# EasyEDA Pro project ProPrj_KernRePeter_2025-12-13.epro

# Schematic KernRePeter
Board Name: RePeter; Create Date: 2025-11-22; Page Name: P1; Project Name: KernRePeter; Schematic Name: KernRePeter; Update Date: 2025-12-12; Company: BreMesh; Page Size: A4; Version: V1.0
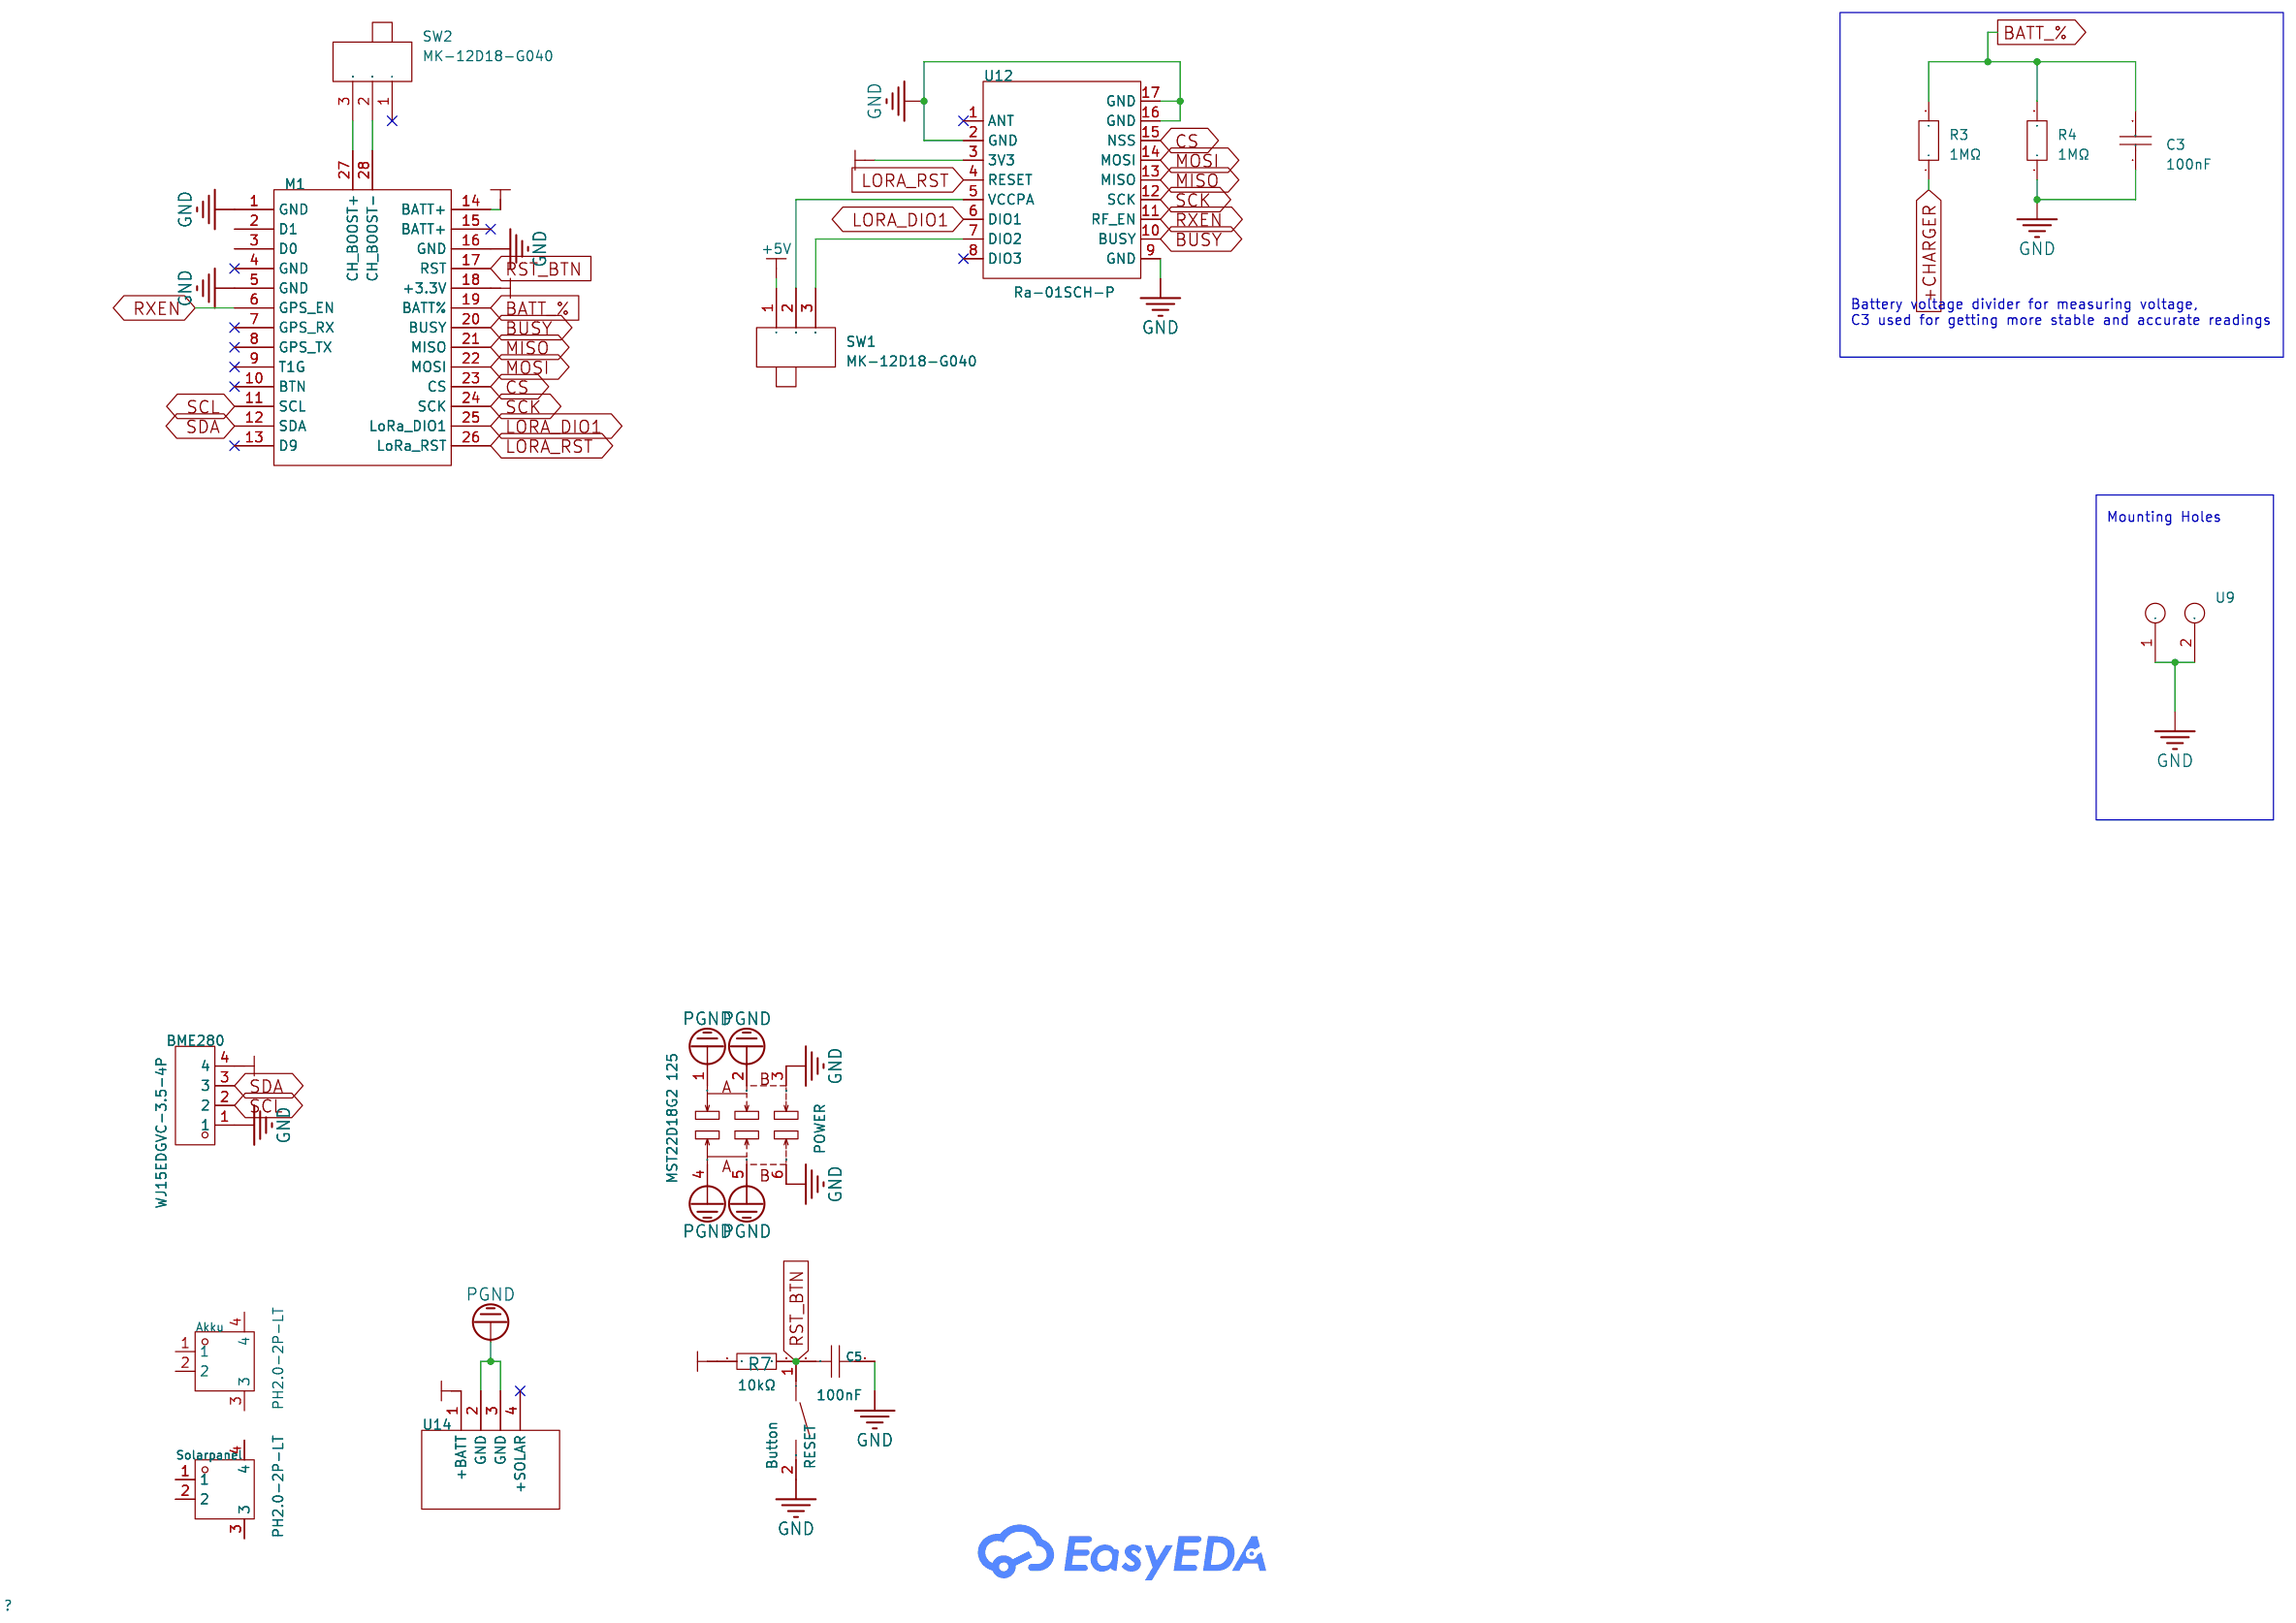
[diagram p0: schematic sheet]

## Parts
Akku  PH2.0-2P-LT  [CONN-SMD_PH2.0-1X2PW]
BME280  WJ15EDGVC-3.5-4P  [CONN-TH_WJ15EDGVC-3.5-4P]
C3  100nF  [C0805]
C5  100nF  [C0603]
M1  ProMicro_NRF52840  [ProMicro_NRF52840]
POWER  MST22D18G2 125  [SW-SMD_MST22D18G2]
R3  1MΩ  [R0805]
R4  1MΩ  [R0805]
R7  10kΩ  [R0603]
RESET  Button  [SW-SMD_L3.9-W3.0-P4.45]
Solarpanel  PH2.0-2P-LT  [CONN-SMD_PH2.0-1X2PW]
SW1  MK-12D18-G040  [SW-TH_MK-12D18-G040]
SW2  MK-12D18-G040  [SW-TH_MK-12D18-G040]
U9  -  [MountingHole_ES101590]
U12  Ra-01SCH-P  [WIRELM-SMD_RA-01SCH-P]
U14  -  [MPPT_Charging_Board]

## Library data of the parts
Akku Solarpanel = PH2.0-2P-LT: Pins Structure:1x2P Pitch:2mm Mounting Type:Surface Mount,Vertical Reference Series:- Number of Pins:2P Number of Rows:1 Number of PINs Per Row:2 Row Spacing:- Current Rating:- Contact Material:Brass Contact Plating:Tin Operating Temperature:- Operating T; LCSC Part Name: 1x2P 间距:2mm 立贴; Supplier Part: C722761; Manufacturer: CAX(创都); Supplier Footprint: SMD,P=2mm; JLCPCB Part Class: Extended Part; Datasheet: https://item.szlcsc.com/datasheet/PH2.0-2P-LT/766968.html; Supplier: LCSC; Pins Structure: 1x2P; Pitch: 2mm; Mounting Type: Surface Mount,Vertical; Number of Pins: 2P; Number of Rows: 1; Number of PINs Per Row: 2; Contact Material: Brass; Contact Plating: Tin; Plastic Material: LCP; Flame Retardant Rating: UL94V-0; Color: Beige; Z-Height of the Board: 6.5mm; X-Length of Bottom Edge on Board (Spacing Line): 8mm; Y-Width of Bottom Edge on Board: 5.4mm
BME280 = WJ15EDGVC-3.5-4P_C5241856: Connector Type:Board Side/Socket - Closed Termination Style:- Number of Positions or Pins:1x4P Pitch:3.5mm Color:- Mounting Type:Straight Pin Number of Pins:4P Number of Rows:1 Number of PINs Per Row:4 Current Rating:- Voltage Rating (Max):- Wire Gauge -; LCSC Part Name: 1x4P 3.5mm 排数:1 每排P数:4; Supplier Part: C5241856; Manufacturer: KANGNEX(康奈克斯电气); Supplier Footprint: 插件,P=3.5mm; JLCPCB Part Class: Extended Part; Datasheet: https://item.szlcsc.com/datasheet/WJ15EDGVC-3.5-4P/5949260.html; Supplier: LCSC; Connector Type: Board Side/Socket - Closed; Number of Positions or Pins: 1x4P; Pitch: 3.5mm; Mounting Type: Straight Pin; Number of Pins: 4P; Number of Rows: 1; Number of PINs Per Row: 4; Operating Temperature: -40℃~+105℃
C3 = 0805B104J500NT: Capacitance:100nF Tolerance:±5% Tolerance:±5% Voltage Rating:50V Temperature Coefficient:X7R; LCSC Part Name: 100nF ±5% 50V; Supplier Part: C29926; Manufacturer: FH(风华); Supplier Footprint: 0805; JLCPCB Part Class: Extended Part; Datasheet: https://item.szlcsc.com/datasheet/0805B104J500NT/30680.html; Supplier: LCSC; Tolerance: ±5%; Voltage Rating: 50V; Temperature Coefficient: X7R
C5 = CL10B104KB8NNNC: Capacitance:100nF Tolerance:±10% Tolerance:±10% Voltage Rating:50V Temperature Coefficient:X7R; LCSC Part Name: 100nF ±10% 50V; Supplier Part: C1591; Manufacturer: SAMSUNG(三星); Supplier Footprint: 0603; JLCPCB Part Class: Extended Part; Datasheet: https://item.szlcsc.com/datasheet/CL10B104KB8NNNC/1943.html; Supplier: LCSC; Tolerance: ±10%; Voltage Rating: 50V; Temperature Coefficient: X7R
M1 = ProMicro_NRF52840
POWER = MST22D18G2 125: Circuit:DPDT Termination Style:Gull Wing Mounting Type:Surface Mount,Vertical Actuator Color:Black Current Rating:100mA Voltage Rating:12V Life:10,000 Cycles Operating Temperature:-25℃~+70℃ Operating Temperature:-25℃~+70℃; LCSC Part Name: 拨动开关/两档立式 6脚贴片 柄长2.0mm 大六立贴 9.1*3.5mm; Supplier Part: C2906280; Manufacturer: SHOU HAN(首韩); Supplier Footprint: SMD; JLCPCB Part Class: Extended Part; Datasheet: https://item.szlcsc.com/datasheet/MST22D18G2%2520125/3178990.html; Supplier: LCSC; Circuit: DPDT; Termination Style: Gull Wing; Mounting Type: Surface Mount,Vertical; Actuator Color: Black; Current Rating: 100mA; Voltage Rating: 12V; Life: 10,000 Cycles; Operating Temperature: -25℃~+70℃
R3 R4 = RT0805BRD071ML: Type:Thin Film Resistor Resistance: Tolerance:±0.1% Tolerance:±0.1% Power(Watts): Overload Voltage (Max): Temperature Coefficient:±25ppm/℃ Temperature Coefficient:±25ppm/℃ Operating Temperature Range:-55℃~+155℃ Operating Temperature Range:-55℃~+155℃; LCSC Part Name: 薄膜电阻 1MΩ ±0.1% 125mW; Supplier Part: C706228; Manufacturer: YAGEO(国巨); Supplier Footprint: 0805; JLCPCB Part Class: Extended Part; Datasheet: https://atta.szlcsc.com/upload/public/pdf/source/20200720/C706228_E467826006C51DA6221B9BCD121425CF.pdf; Supplier: LCSC; Type: Thin Film Resistor; Tolerance: ±0.1%; Temperature Coefficient: ±25ppm/℃; Operating Temperature Range: -55℃~+155℃
R7 = 0603WAF1002T5E: Type:Thick Film Resistor Resistance:10kΩ Tolerance:±1% Tolerance:±1% Power(Watts):100mW Voltage-Supply(Max):75V Temperature Coefficient:±100ppm/℃ Temperature Coefficient:±100ppm/℃ Operating Temperature:-55℃~+155℃ Operating Temperature:-55℃~+155℃; LCSC Part Name: 厚膜电阻 10kΩ ±1% 100mW; Supplier Part: C25804; Manufacturer: UNI-ROYAL(厚声); Supplier Footprint: 0603; JLCPCB Part Class: Basic Part; Datasheet: https://item.szlcsc.com/datasheet/0603WAF1002T5E/26547.html; Supplier: LCSC; Type: Thick Film Resistor; Tolerance: ±1%; Power(Watts): 100mW; Voltage-Supply(Max): 75V; Temperature Coefficient: ±100ppm/℃; Operating Temperature: -55℃~+155℃
RESET = TS-1088-AR02016: Circuit:SPST Actuator Style:Round Button Operating Force:1.6N Mounting Type:Surface Mount,Vertical Length:4mm Width:3mm Switch Height:2mm with Bracket:Without Bracket Contact Current:50mA Voltage Rating:12V Actuator/Cap Color:Black Termination Style:SMD(S; LCSC Part Name: 4*3*2mm 立贴 轻触开关; Supplier Part: C720477; Manufacturer: XUNPU(讯普); Supplier Footprint: SMD,4x3mm; JLCPCB Part Class: Basic Part; Datasheet: https://item.szlcsc.com/datasheet/TS-1088-AR02016/763484.html; Supplier: LCSC; Circuit: SPST; Actuator Style: Round Button; Operating Force: 1.6N; Mounting Type: Surface Mount,Vertical; Length: 4mm; Width: 3mm; Switch Height: 2mm; with Bracket: Without Bracket; Contact Current: 50mA; Voltage Rating: 12V; Actuator/Cap Color: Black; Termination Style: SMD(SMT) Tab; Life: 100,000 Cycles; Operating Temperature: -30℃~+80℃
SW1 SW2 = MK-12D18-G040: Circuit:SPDT Actuator Style:Rectangular columnar Pin Style:PCPin Switch Length:8.55mm Switch Width:3.8mm Mounting Style:- Actuator Color:Black Current Rating (DC):1A Voltage Rating (DC):6V Mechanical Life:1万次 Operating Temperature:-20℃~+70℃ Operating Temp; LCSC Part Name: 微型拨动开关; Supplier Part: C963202; Manufacturer: G-Switch(品赞); Supplier Footprint: 插件; JLCPCB Part Class: Extended Part; Datasheet: https://atta.szlcsc.com/upload/public/pdf/source/20201201/C963202_825FB742C5BA766BED52E1DDA96DE5A3.pdf; Supplier: LCSC; Circuit: SPDT; Actuator Style: Rectangular columnar; Pin Style: PCPin; Switch Length: 8.55mm; Switch Width: 3.8mm; Actuator Color: Black; Current Rating (DC): 1A; Voltage Rating (DC): 6V; Mechanical Life: 1万次; Operating Temperature: -20℃~+70℃
U9 = MountingHoles_ES101590
U12 = Ra-01SCH-P: Output Power:31dBm Output Power:31dBm Interface Type:SPI Modulation System:LoRa；GFSK；FSK Voltage - Supply:3V~3.6V Voltage - Supply:3V~3.6V Antenna Type:IPEX Connector Receive  Current:16mA Send  Current:1A Sensitivity:-137dBm Sensitivity:-137dBm; Supplier Part: C41368034; Manufacturer: Ai-Thinker(安信可); Supplier Footprint: SMD,17x16mm; JLCPCB Part Class: Extended Part; Datasheet: https://item.szlcsc.com/datasheet/Ra-01SCH-P/43122705.html; Supplier: LCSC; Output Power: 31dBm; Interface Type: SPI; Modulation System: LoRa；GFSK；FSK; Voltage - Supply: 3V~3.6V; Antenna Type: IPEX Connector; Receive  Current: 16mA; Send  Current: 1A; Sensitivity: -137dBm
U14 = CN3791 MPPT Solar Charger v1.0

## Nets
+3.3V: BME280.4 M1.18(+3.3V) R7.1 U12.3(3V3)
+5V: SW1.1
GND: BME280.1 C3.1 C5.2 M1.1(GND) M1.5(GND) M1.16(GND) POWER.3 POWER.6 R4.1 RESET.2 U9.1 U9.2 U12.2(GND) U12.9(GND) U12.16(GND) U12.17(GND)
PGND: POWER.1 POWER.2 POWER.4 POWER.5 U14.2(GND) U14.3(GND)
+CHARGER: M1.14(BATT+) R3.1 U14.1(+BATT)
BATT_%: C3.2 M1.19(BATT%) R3.2 R4.2
BUSY: M1.20(BUSY) U12.10(BUSY)
CS: M1.23(CS) U12.15(NSS)
LORA_DIO1: M1.25(LoRa DIO1) U12.6(DIO1)
LORA_RST: M1.26(LoRa RST) U12.4(RESET)
MISO: M1.21(MISO) U12.13(MISO)
MOSI: M1.22(MOSI) U12.14(MOSI)
RST_BTN: C5.1 M1.17(RST) R7.2 RESET.1
RXEN: M1.6(GPS_EN) U12.11(RF_EN)
SCK: M1.24(SCK) U12.12(SCK)
SCL: BME280.2 M1.11(SCL)
SDA: BME280.3 M1.12(SDA)
$1N567: SW1.2 U12.5(VCCPA)
$1N14763: SW1.3 U12.7(DIO2)
$1N15587: M1.28(CH_BOOST-) SW2.2
$1N15596: M1.27(CH_BOOST+) SW2.3

Not connected (* = marked no-connect by the designer): Akku 1 2 3 4; M1 2(D1) 3(D0) 4(GND)* 7(GPS_RX)* 8(GPS_TX)* 9(T1G)* 10(BTN)* 13(D9)* 15(BATT+)*; Solarpanel 1 2 3 4; SW2 1*; U12 1(ANT)* 8(DIO3)*; U14 4(+SOLAR)*

## Notes on the sheet
- Battery voltage divider for measuring voltage,
  C3 used for getting more stable and accurate readings
- Mounting Holes

# Board RePeter
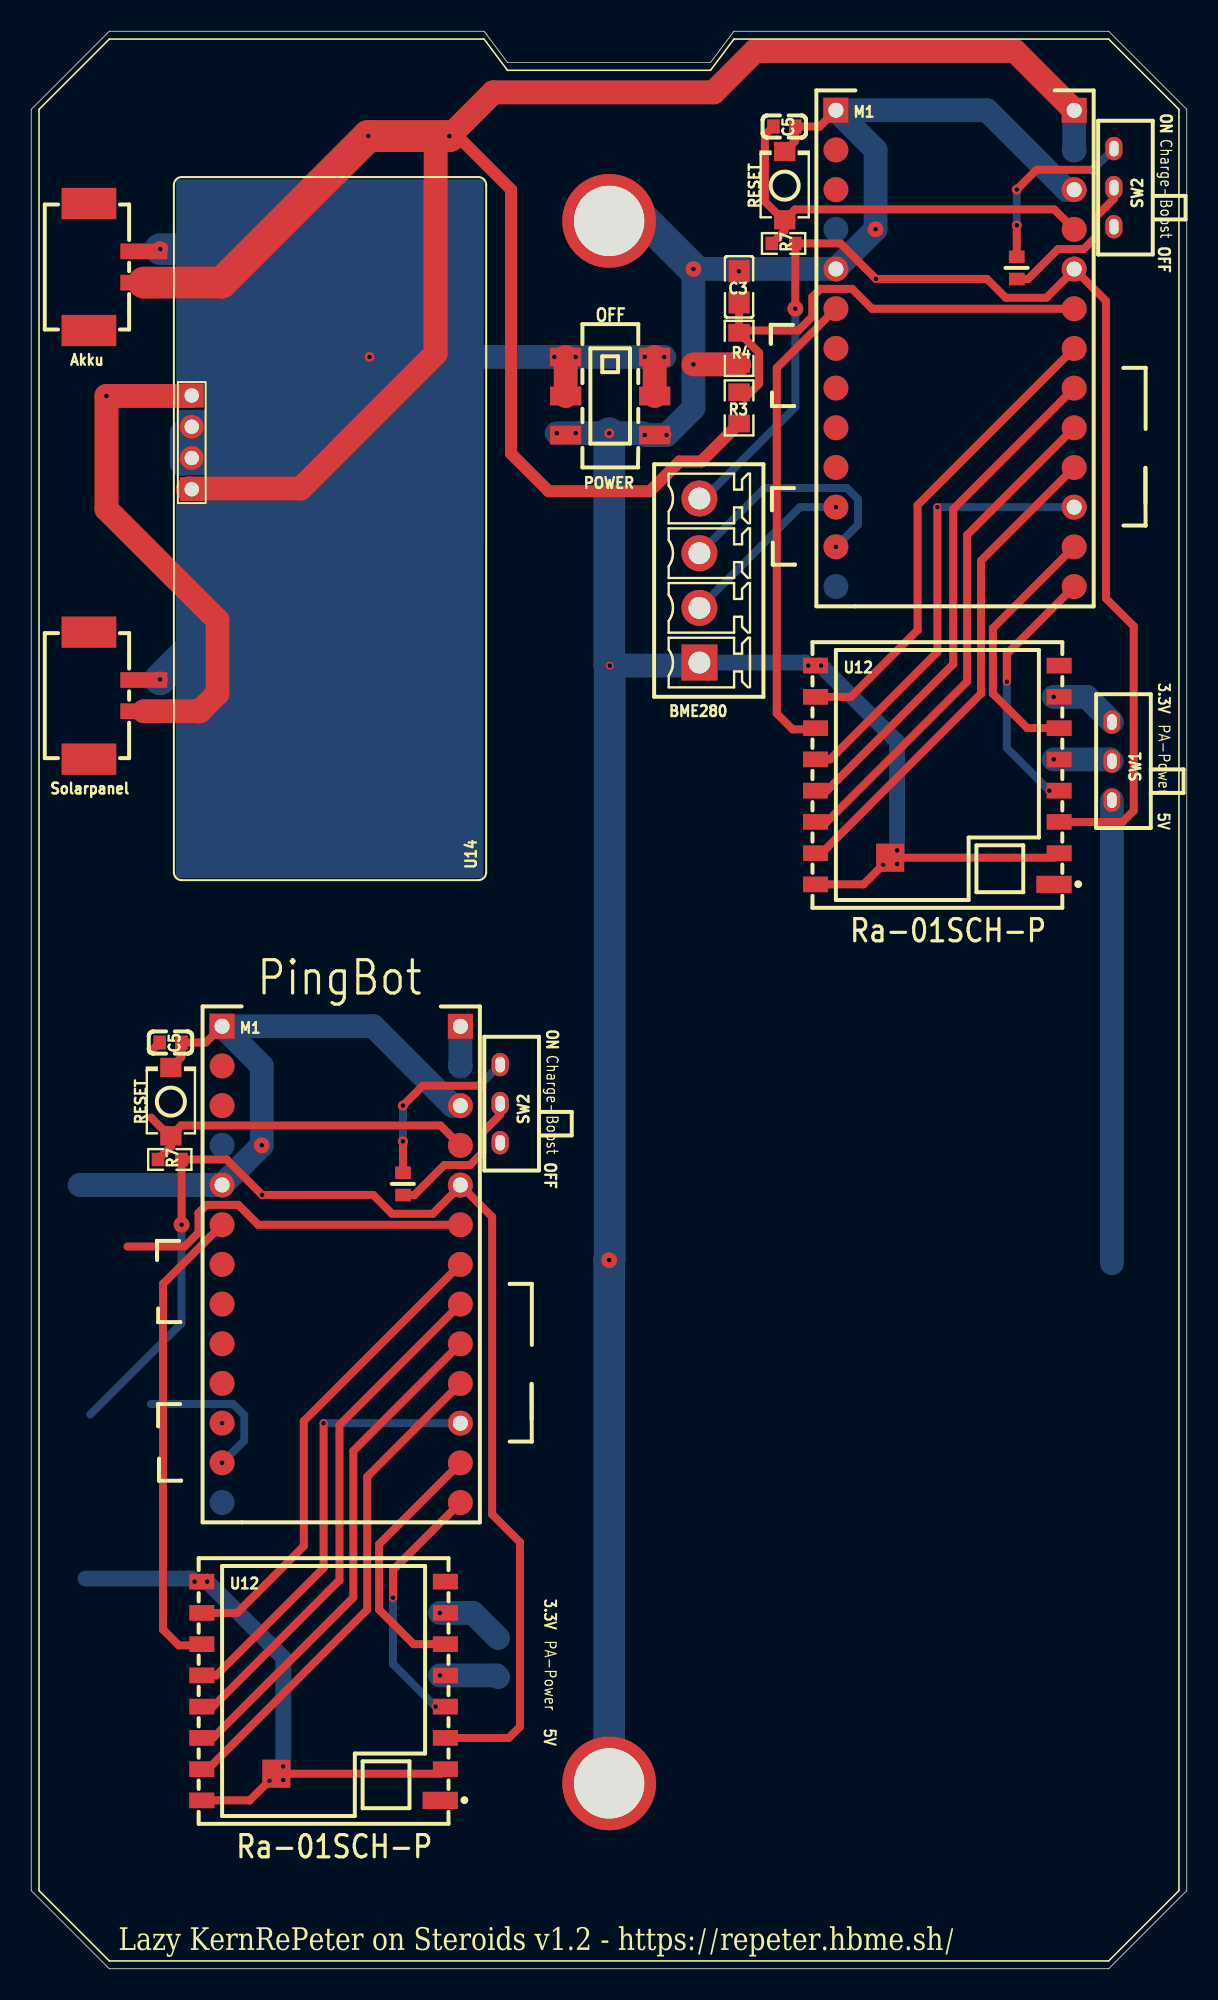
[diagram p1: board, top side]
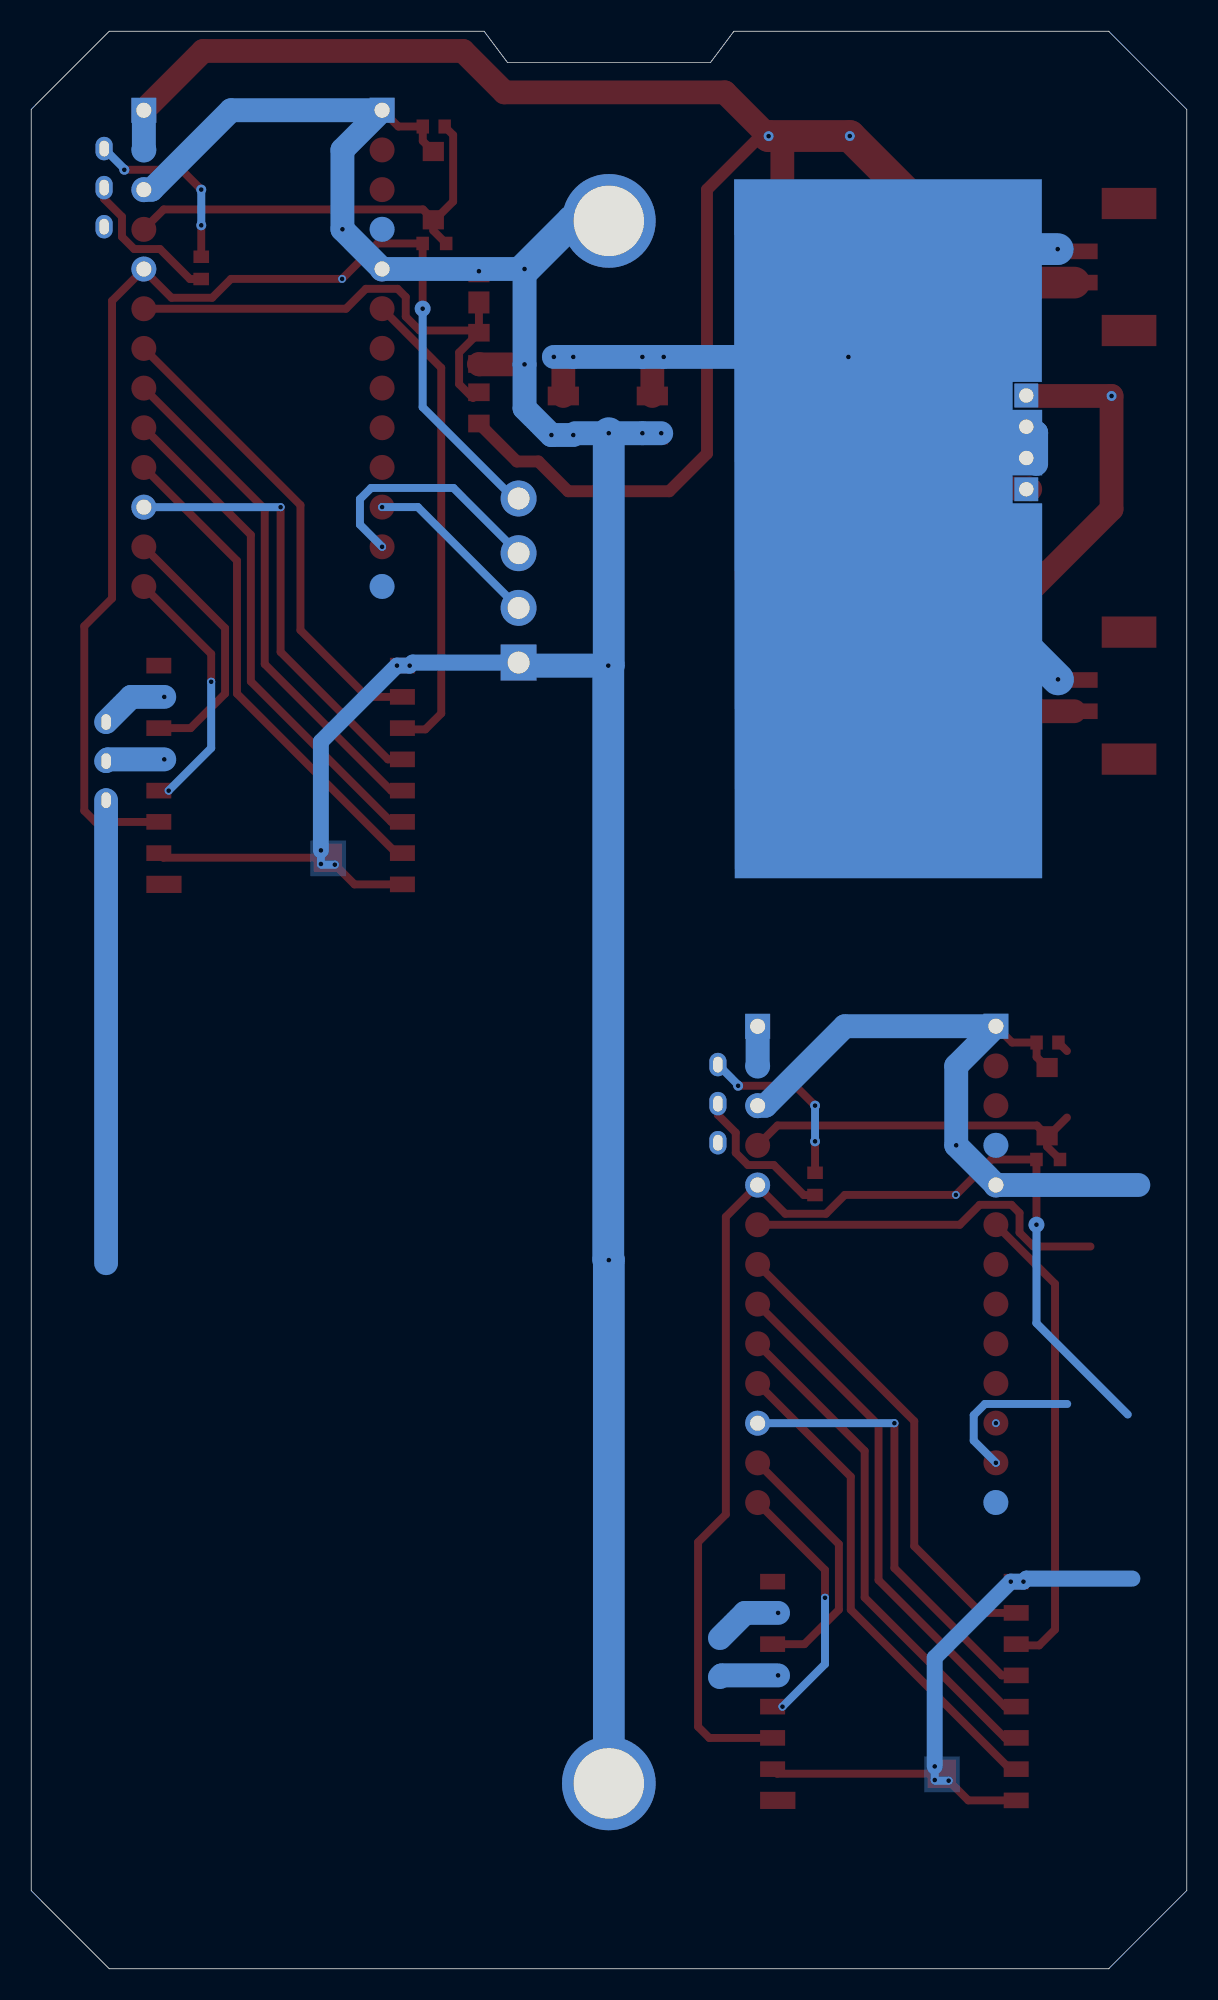
[diagram p2: board, bottom side, seen from below]

Outline 74 x 124 mm; copper layers: Top Layer, Bottom Layer. Coordinates in mm from the lower left corner of the outline.
Outline path: 0,119 0,5 5,0 69,0 74,5 74,119 69,124 45,124 43.5,122 30.5,122 29,124 5,124 0,119
Stack: Top Layer 0.0009mm / dielectric 1 0.0384mm FR4 er 4.5 / Bottom Layer 0.0009mm

## Design rules (mm)
spacing safeClearance (default): track to track 0, other pairs 0 to 0.5
track width trackWidth (default): min 0.127, default 0.254, max 2.54
differential pair differentialPair (default): width min 0.127, default 0.254, max 2.54; gap min 0.152, default 0.152
via viaSize (default): diameter min 0.5, default 0.61, max 10; hole min 0.3, default 0.305, max 6

## Placement (name value [footprint] x y rotation side)
Akku  PH2.0-2P-LT  [CONN-SMD_PH2.0-1X2PW]  5.45 108.91 90 top
BME280  WJ15EDGVC-3.5-4P  [CONN-TH_WJ15EDGVC-3.5-4P]  42.79 88.85 90 top
C3  100nF  [C0805]  45.33 107.64 270 top
C5  100nF  [C0603]  8.92 59.28 0 top
C5#2  -  [C0603]  48.23 117.9 0 top
M1  -  [ProMicro_NRF52840]  12.25 45.08 0 top
M1#2  -  [ProMicro_NRF52840]  51.55 103.7 0 top
POWER  MST22D18G2 125  [SW-SMD_MST22D18G2]  37.07 100.66 270 top
R3  1MΩ  [R0805]  45.33 99.89 90 top
R4  1MΩ  [R0805]  45.33 103.7 90 top
R7  10kΩ  [R0603]  8.87 51.79 180 top
R7#2  -  [R0603]  48.18 110.42 180 top
RESET  Button  [SW-SMD_L3.9-W3.0-P4.45]  8.94 55.49 90 top
RESET#2  -  [SW-SMD_L3.9-W3.0-P4.45]  48.25 114.12 90 top
Solarpanel  PH2.0-2P-LT  [CONN-SMD_PH2.0-1X2PW]  5.45 81.48 90 top
SW1  MK-12D18-G040  [SW-TH_MK-12D18-G040]  69.21 77.29 90 top
SW2  MK-12D18-G040  [SW-TH_MK-12D18-G040]  30.03 55.37 90 top
SW2#2  -  [SW-TH_MK-12D18-G040]  69.33 113.99 90 top
U9  -  [MountingHole_ES101590]  37.01 111.86 0 top
U12  Ra-01SCH-P  [WIRELM-SMD_RA-01SCH-P]  18.72 17.78 180 top
U12#2  -  [WIRELM-SMD_RA-01SCH-P]  58.03 76.4 180 top
U14  -  [MPPT_Charging_Board]  9.14 69.67 90 top

## Footprints (pads in the part's own frame, mm; a bottom-side part is the same pattern mirrored in y, then rotated)
C0603
  rect 0.8x0.9 smd: 1(-0.7,0) 2(0.7,0)
C0805
  rect 1.41x1.35 smd: 1(-1,0) 2(1,0)
CONN-SMD_PH2.0-1X2PW
  rect 1x3 smd: 1(-1,-1.756) 2(1,-1.756)
  rect 2x3.5 smd: 3(4.064,1.756) 4(-4.064,1.756)
CONN-TH_WJ15EDGVC-3.5-4P
  rect 2.3x2.3 hole 1.4: 1(-5.25,0)
  round 2.3 hole 1.4: 2(-1.75,0) 3(1.75,0) 4(5.25,0)
MountingHole_ES101590
  round 6 hole 4.5: 1(0,0) 2(0,-100)
MPPT_Charging_Board
  rect 1.524x1.524 hole 0.914: 1(25.019,-1.143) 4(31.019,-1.143)
  round 1.524 hole 0.914: 2(27.019,-1.143) 3(29.019,-1.143)
ProMicro_NRF52840
  rect 1.6x1.6 hole 0.96: 1(-0.022,15.24) 14(15.236,15.236)
  round 1.6 smd: 2(-0.022,12.7) 3(-0.022,10.16) 6(-0.022,2.54) 7(-0.022,0) 8(-0.022,-2.54) 9(-0.022,-5.08) 10(-0.022,-7.62) 11(-0.022,-10.16) 12(-0.022,-12.7) 17(15.236,7.616) 19(15.236,2.536) 20(15.236,-0.004) 21(15.236,-2.544) 22(15.236,-5.084) 23(15.236,-7.624) 25(15.236,-12.704) 26(15.236,-15.244)
  round 1.6 smd far side: 4(-0.022,7.62) 13(-0.02,-15.24) 15(15.236,12.696)
  round 1.6 hole 0.5x0.96: 5(-0.022,5.08) 16(15.236,10.156) 18(15.236,5.076)
  round 1.6 hole 0.96: 24(15.236,-10.164)
  rect 1x0.8 smd: 27(11.559,5.863) 28(11.564,4.438)
R0603
  rect 0.806x0.864 smd: 1(-0.753,0) 2(0.753,0)
R0805
  rect 1.133x1.377 smd: 1(-1,0) 2(1,0)
SW-SMD_L3.9-W3.0-P4.45
  rect 1.23x1.36 smd: 1(-2.185,0) 2(2.185,0)
SW-SMD_MST22D18G2
  rect 1.2x2 smd: 1(-2.5,2.85) 2(0,2.85) 3(2.5,2.85) 4(-2.5,-2.85) 5(0,-2.85) 6(2.5,-2.85)
SW-TH_MK-12D18-G040
  oval 1.5x1.1 hole 1x0.6: 1(-2.5,0) 2(0,0) 3(2.5,0)
WIRELM-SMD_RA-01SCH-P
  rect 2.26x1.1 smd: 1(-7.47,7)
  rect 1.6x1 smd: 2(-7.8,5) 3(-7.8,3) 4(-7.8,1) 5(-7.8,-1) 6(-7.8,-3) 7(-7.8,-5) 8(-7.8,-7) 9(7.8,-7) 10(7.8,-5) 11(7.8,-3) 12(7.8,-1) 13(7.8,1) 14(7.8,3) 15(7.8,5) 16(7.8,7)
  rect 1.8x1.8 smd: 17(3.025,5.292)

## Nets
+3.3V: BME280.4 M1.18 M1#2.18 R7.1 R7#2.1 U12.3 U12#2.3
+5V: SW1.1
GND: BME280.1 C3.1 C5.2 C5#2.2 M1.1 M1.5 M1.16 M1#2.1 M1#2.5 M1#2.16 POWER.3 POWER.6 R4.1 RESET.2 RESET#2.2 U9.1 U9.2 U12.2 U12.9 U12.16 U12.17 U12#2.2 U12#2.9 U12#2.16 U12#2.17
PGND: POWER.1 POWER.2 POWER.4 POWER.5 U14.2 U14.3
+CHARGER: M1.14 M1#2.14 R3.1 U14.1
BATT_%: C3.2 M1.19 M1#2.19 R3.2 R4.2
BUSY: M1.20 M1#2.20 U12.10 U12#2.10
CS: M1.23 M1#2.23 U12.15 U12#2.15
LORA_DIO1: M1.25 M1#2.25 U12.6 U12#2.6
LORA_RST: M1.26 M1#2.26 U12.4 U12#2.4
MISO: M1.21 M1#2.21 U12.13 U12#2.13
MOSI: M1.22 M1#2.22 U12.14 U12#2.14
RST_BTN: C5.1 C5#2.1 M1.17 M1#2.17 R7.2 R7#2.2 RESET.1 RESET#2.1
RXEN: M1.6 M1#2.6 U12.11 U12#2.11
SCK: M1.24 M1#2.24 U12.12 U12#2.12
SCL: BME280.2 M1.11 M1#2.11
SDA: BME280.3 M1.12 M1#2.12
$1N567: SW1.2 U12.5 U12#2.5
$1N14763: SW1.3 U12.7 U12#2.7
$1N15587: M1.28 M1#2.28 SW2.2 SW2#2.2
$1N15596: M1.27 M1#2.27 SW2.3 SW2#2.3

Pads without a net: Akku 1 2 3 4; M1 2 3 4 7 8 9 10 13 15; M1#2 2 3 4 7 8 9 10 13 15; Solarpanel 1 2 3 4; SW2 1; SW2#2 1; U12 1 8; U12#2 1 8; U14 4

## Via types
v1: diameter 0.635, hole 0.305, Top Layer to Bottom Layer, 19 vias
v2: diameter 0.508, hole 0.305, Top Layer to Bottom Layer, 26 vias
v3: diameter 1.016, hole 0.305, Top Layer to Bottom Layer, 9 vias
v4: diameter 0.889, hole 0.305, Top Layer to Bottom Layer, 2 vias

## Routing (per net, layer and track width the routed paths; a pad name or vN(x,y) marks a point on that pad's centre or on a via; arc(x,y) is an arc through that point)
+3.3V: length 160.6
  Top Layer w0.508: U12#2.3 65.83,73.4 69.88,73.4 70.6,74.11 70.6,85.92 68.82,87.7 68.82,106.75 M1#2.18 66.79,108.72 65.01,106.94 62.41,106.94 61.21,108.15 v2(54.09,108.15) 51.82,110.42 R7#2.1 v3(48.93,106.25) ; v3(9.63,47.62) R7.1 12.52,51.79 v2(14.79,49.53) 21.9,49.53 23.1,48.32 25.71,48.32 27.48,50.09 M1.18 29.52,48.12 29.52,29.08 31.3,27.3 31.3,15.49 30.58,14.77 26.53,14.77 U12.3
  Bottom Layer w0.508: v3(48.93,106.25) 48.93,99.94 43.09,94.1 BME280.4 ; v3(9.63,47.62) 9.63,41.32 3.78,35.47
+5V: length 29.6
  Bottom Layer w1.524: SW1.1 69.21,45.16
GND: length 287.3
  Top Layer w0.508: U12#2.16 53.3,69.4 v2(54.56,70.66) U12#2.17 65.54,71.11 U12#2.2 ; M1#2.1 50.49,117.9 C5#2.2 48.93,116.98 RESET#2.2 ; RESET.2 9.62,58.35 C5.2 11.18,59.28 M1.1 ; U12.2 26.23,12.48 U12.17 v2(15.25,12.04) 13.99,10.78 U12.16
  Top Layer w1.524: v3(42.41,102.68) 45.31,102.68 R4.1
  Bottom Layer w0.508: v2(55.45,71.57) v2(55.45,70.7) 55.41,70.66 v2(54.56,70.66) ; v2(15.25,12.04) 16.1,12.04 v2(16.14,12.08) v2(16.14,12.95)
  Bottom Layer w1.016: v2(16.14,12.95) 16.14,19.91 v2(11.27,24.78) v2(10.46,24.78) 10.26,24.97 3.48,24.97 ; BME280.1 49.57,83.6 v2(49.77,83.4) v2(50.58,83.4) 55.45,78.53 v2(55.45,71.57)
  Bottom Layer w1.524: BME280.1 42.59,83.4 v2(37.05,83.4) ; M1#2.16 66.29,113.86 61.21,118.94 M1#2.1 54.07,116.41 v3(54.07,111.33) M1#2.5 v3(42.41,108.78) v3(42.41,102.68) 42.41,99.88 v1(40.69,98.16) v2(39.29,98.16) ; M1.16 26.98,55.24 21.9,60.32 M1.1 14.76,57.78 v3(14.76,52.7) M1.5 3.1,50.16 ; 39.17,98.27 v1(37.02,98.27) v2(34.86,98.27) v2(33.65,98.27)
  Bottom Layer w2.032: v1(37.02,98.27) 37.02,83.43 v2(37.05,83.4) 37.05,45.39 v3(37.01,45.35) U9.2 ; v3(42.41,108.78) 39.33,111.86 U9.1
  vias: v1(45.33,108.64)
PGND: length 82.4
  Top Layer w1.524: POWER.4 34.22,100.66 ; POWER.1 POWER.2
  Bottom Layer w1.524: 9.64,96.31 9.64,98.31 16.82,98.31 v1(21.67,103.16) v1(33.5,103.16) v1(34.86,103.16) v1(39.29,103.16) v1(40.53,103.16)
  Bottom Layer w2.032: v3(8.27,110.06) 14.77,110.06 v1(21.67,103.16) 21.67,95.94 v3(8.25,82.52)
(no net): length 50.9
  Top Layer w1.524: U14.4 10.25,100.66 v1(4.82,100.66) 4.82,93.42 11.93,86.31 11.93,81.61 10.8,80.48 Solarpanel.1
  Top Layer w2.032: Akku.1 12.2,107.91 21.58,117.29
+CHARGER: length 126.8
  Top Layer w0.762: R3.1 42.9,96.47 41.52,96.47 39.62,94.56 33.14,94.56 30.72,96.97 30.72,113.87 27.31,117.28
  Top Layer w1.524: 26.22,117.28 25.9,116.96 25.9,103.37 17.26,94.74 10.07,94.74 10.02,94.69 ; v1(26.78,117.28) 29.58,120.09 43.7,120.09 46.35,122.74 62.99,122.74 M1#2.14
  Top Layer w2.032: v1(21.58,117.29) 26.77,117.29 v1(26.78,117.28)
  Bottom Layer w1.524: M1.14 27.48,57.78 ; M1#2.14 66.79,116.4
BATT_%: length 54.6
  Top Layer w0.508: R4.2 46.6,103.44 46.6,101.42 45.7,100.52 ; R4.2 45.47,104.85 49.13,104.85 50.02,105.74 50.02,106.99 50.54,107.52 52.57,107.52 53.84,106.24 M1#2.19 ; R4.2 C3.2 ; M1.19 14.54,47.62 13.26,48.89 11.23,48.89 10.71,48.37 10.71,47.11 9.82,46.22 6.17,46.22
BUSY: length 61
  Top Layer w0.508: U12#2.10 52.49,81.4 56.76,85.67 56.76,93.67 M1#2.20 ; M1.20 17.45,35.05 17.45,27.05 13.18,22.78 U12.10
CS: length 63.5
  Top Layer w0.508: U12#2.15 50.62,71.4 60.82,81.61 60.82,90.12 M1#2.23 ; U12.15 11.31,12.78 21.52,22.98 21.52,31.49 M1.23
LORA_DIO1: length 33.4
  Top Layer w0.508: M1.25 22.28,27.17 22.28,22.98 24.49,20.78 U12.6 ; U12#2.6 63.79,79.4 61.59,81.61 61.59,85.8 M1#2.25
LORA_RST: length 32
  Top Layer w0.508: M1#2.26 62.47,84.15 v2(62.47,82.37) ; M1.26 23.17,25.52 v2(23.17,23.74)
  Bottom Layer w0.508: v2(23.17,23.74) 23.17,19.5 v2(25.89,16.78) ; v2(65.2,75.4) 62.47,78.12 v2(62.47,82.37)
MISO: length 66.1
  Top Layer w0.508: M1#2.21 59.05,93.42 59.05,83.5 50.95,75.4 U12#2.13 ; U12.13 11.64,16.78 19.74,24.87 19.74,34.79 M1.21
MOSI: length 65
  Top Layer w0.508: U12.14 11.64,14.78 20.63,23.76 20.63,33.14 M1.22 ; U12#2.14 50.95,73.4 59.94,82.39 59.94,91.77 M1#2.22
RST_BTN: length 51.7
  Top Layer w0.508: RESET#2.1 48.25,111.24 R7#2.2 ; RESET#2.1 48.15,111.93 46.98,113.1 46.98,117.36 C5#2.1 ; RESET#2.1 48.91,112.59 65.51,112.59 M1#2.17 ; M1.17 26.21,53.97 9.6,53.97 RESET.1 ; RESET.1 8.94,52.62 R7.2 ; RESET.1 8.84,53.31 7.67,54.48 ; C5.1 7.67,58.73
RXEN: length 60.8
  Top Layer w0.508: M1.6 8.44,43.83 8.44,21.71 9.45,20.7 10.84,20.7 U12.11 ; M1#2.6 47.74,102.46 47.74,80.34 48.76,79.32 50.15,79.32 U12#2.11
SCK: length 57.3
  Top Layer w0.508: v2(18.72,34.92) 18.72,25.65 11.85,18.78 U12.12 ; U12#2.12 51.16,77.4 58.03,84.27 v2(58.03,93.54)
  Bottom Layer w0.508: M1.24 v2(18.72,34.92) ; M1#2.24 v2(58.03,93.54)
SCL: length 11.4
  Bottom Layer w0.508: v2(51.53,93.55) 49.24,93.55 BME280.2
  vias: v2(12.22,34.92)
SDA: length 25.7
  Bottom Layer w0.508: 7.66,36.15 12.92,36.15 13.64,35.43 13.64,33.8 v2(12.22,32.38) ; v2(51.53,91) 52.95,92.42 52.95,94.05 52.23,94.77 46.97,94.77 BME280.3
$1N567: length 7.5
  Bottom Layer w1.524: 29.9,18.66 29.79,18.78 v4(26.17,18.78) ; SW1.2 69.09,77.4 v4(65.48,77.4)
$1N14763: length 8.8
  Bottom Layer w1.524: v1(26.17,22.78) 28.29,22.78 29.9,21.16 ; v1(65.48,81.4) 67.59,81.4 SW1.3
$1N15587: length 19.6
  Top Layer w0.508: M1.28 24.53,49.52 26.45,51.44 28.1,51.44 28.88,52.22 28.88,53.51 30.03,54.65 SW2.2 ; SW2#2.2 69.33,113.27 68.19,112.13 68.19,110.84 67.41,110.06 65.75,110.06 63.84,108.14 M1#2.28
$1N15596: length 23.3
  Top Layer w0.508: M1#2.27 v1(63.11,111.58) ; v1(63.11,113.87) 64.38,115.13 v1(68.04,115.13) ; v1(23.8,55.24) 25.07,56.51 v1(28.73,56.51) ; M1.27 v1(23.8,52.95)
  Bottom Layer w0.508: v1(23.8,52.95) v1(23.8,55.24) ; v1(63.11,111.58) v1(63.11,113.87) ; 67.98,115.13 SW2#2.3 ; 28.67,56.51 SW2.3

## Copper pours and planes (outline as drawn; the poured copper is in the pictures)
GND on Bottom Layer: 53.84,72.21 56.12,72.21 56.12,69.92 53.84,69.92
GND on Bottom Layer: 14.53,13.58 16.82,13.58 16.82,11.3 14.53,11.3

## Text on the board
Top Silkscreen Layer: GND | BSY | RX | SCK | MIO | MSI | CS | IO3 | IO2 | IO1 | PA+ | RST | 3.3 | ANT | PA-Power | Charge-Boost | 5V | 3.3V | OFF | ON | Ra-01SCH-P | PingBot | Lazy KernRePeter on Steroids v1.2 - https://repeter.hbme.sh/
